# Altium schematic sheet PLIS_POWER.SchDoc
size 420 x 297 mm; Address1: Address1; Address2: Address2; Address3: Address3; Address4: Address4; DocumentNumber: Э3; SheetNumber: 3; SheetTotal: 5; Scale: 1:1; DocumentType: Схема электрическая принципиальная; FirstReferrence: АБВГ.123456.001
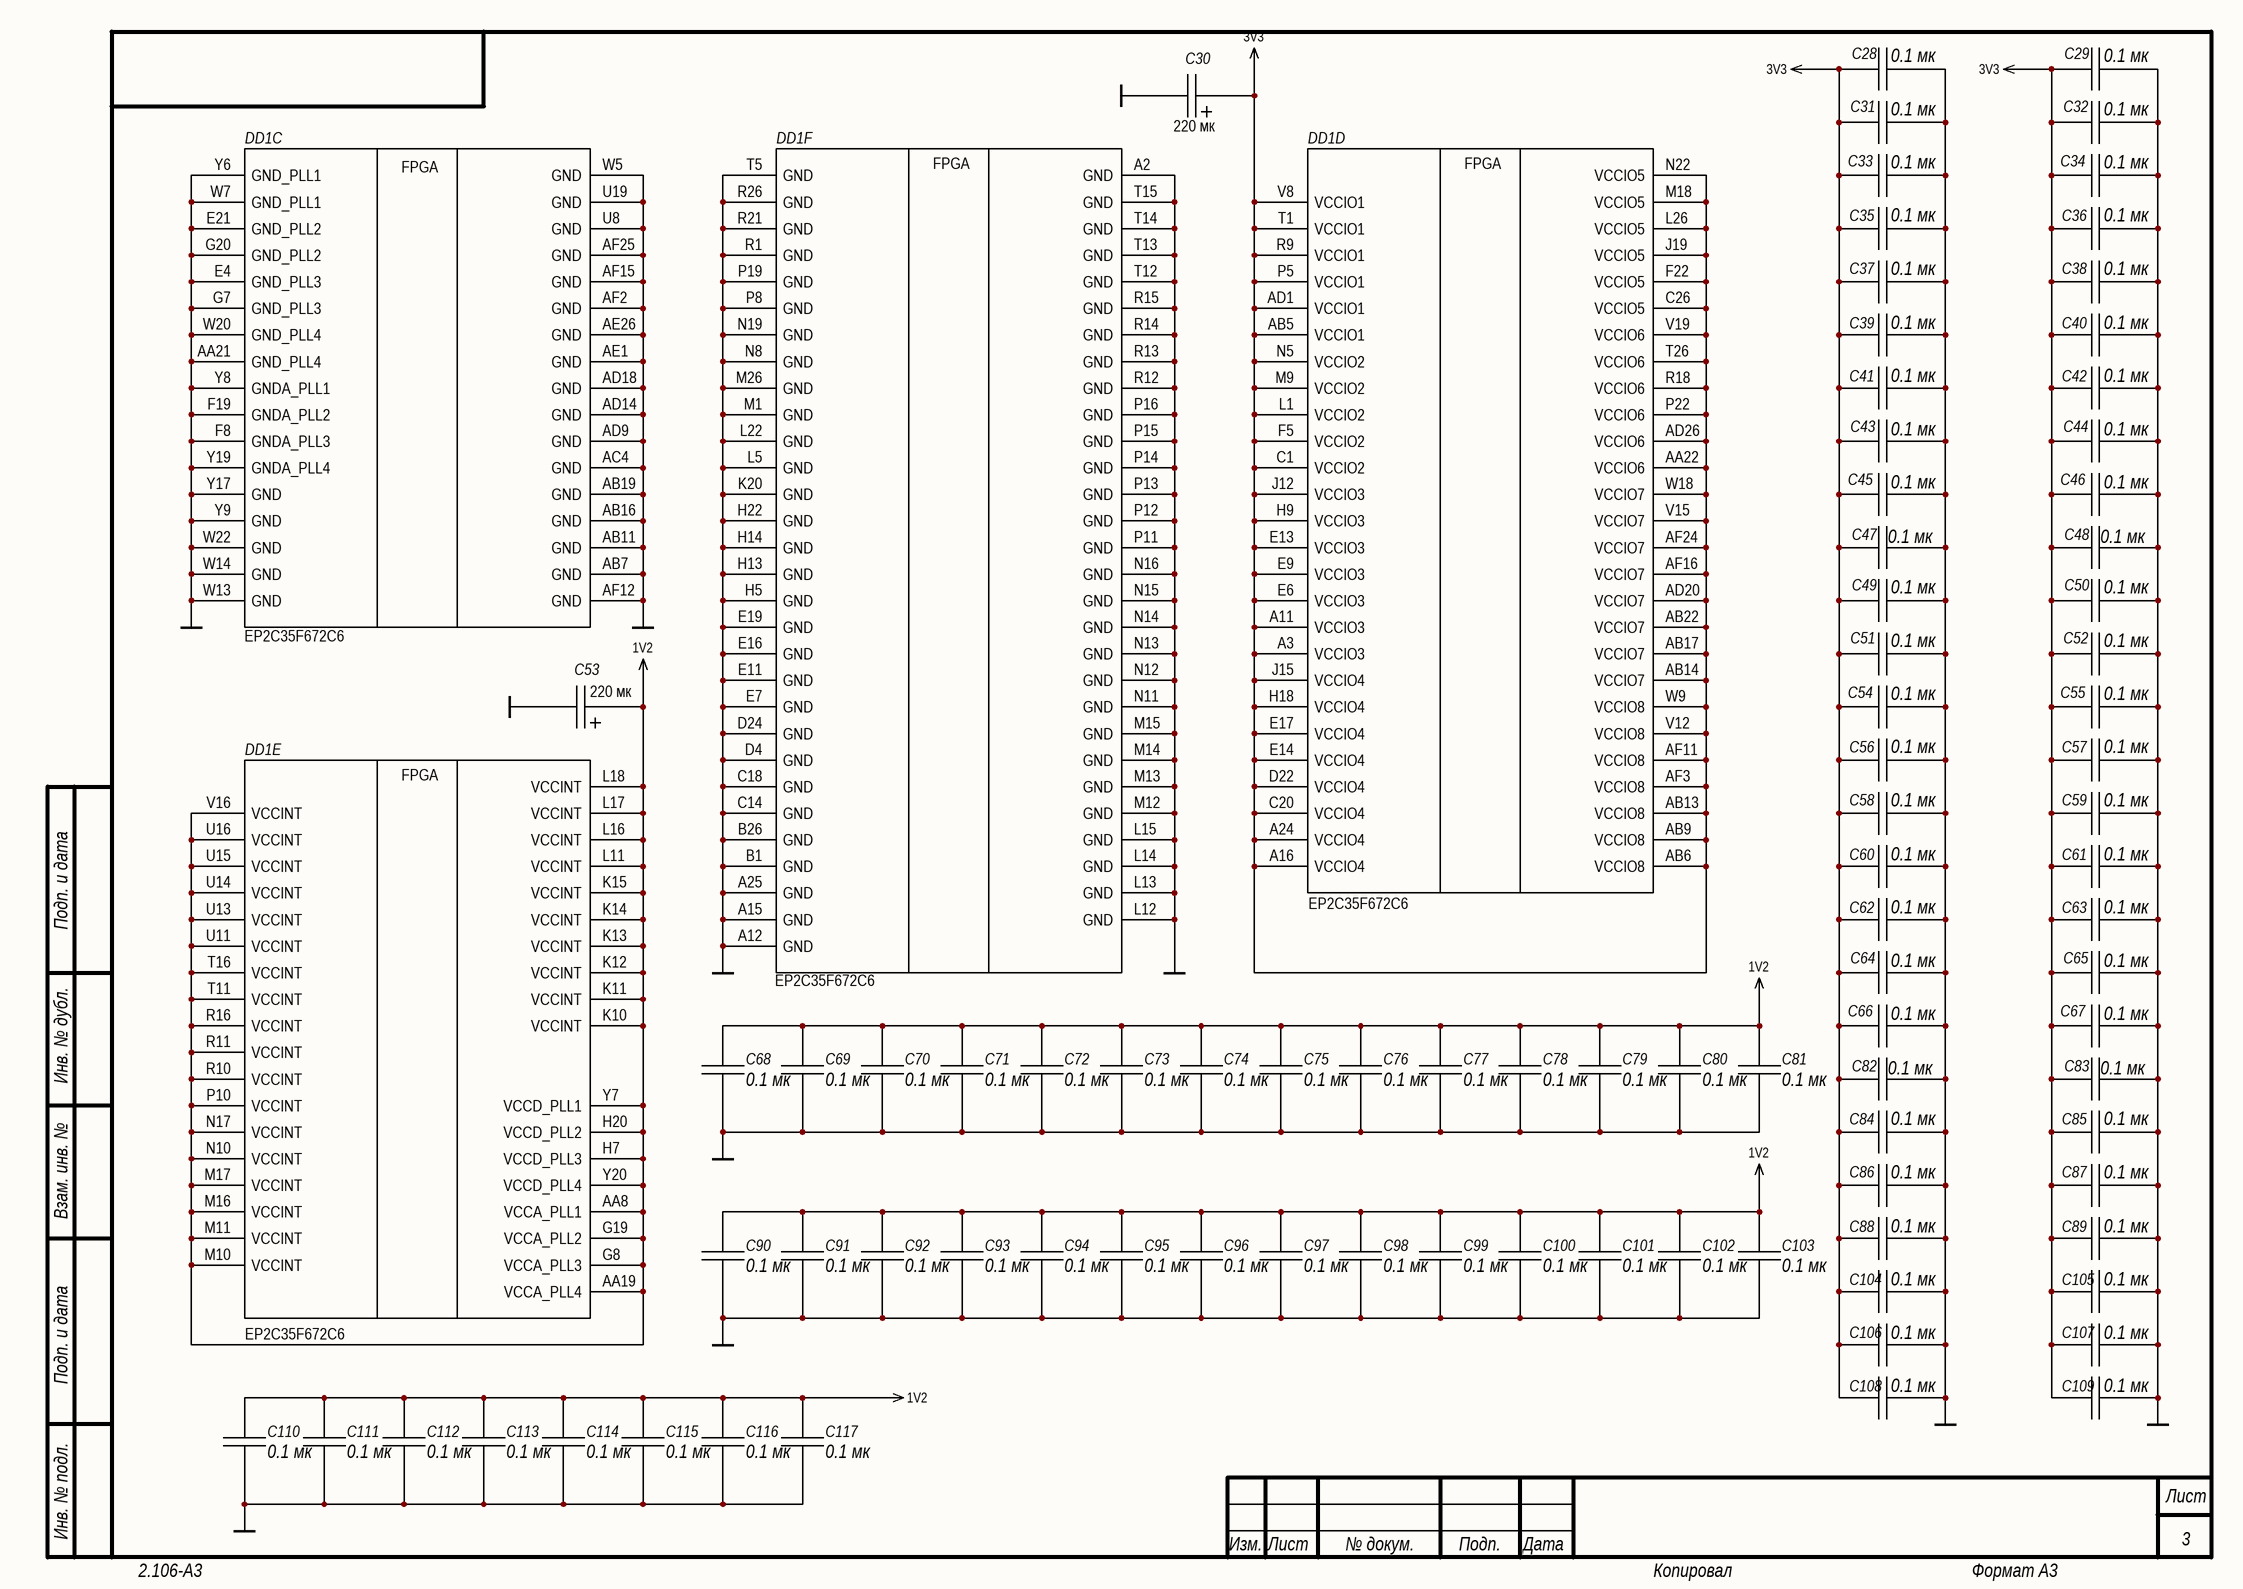
[diagram p0: PLIS_POWER.SchDoc]

## Parts
C28  0.1 мк
C29  0.1 мк
C30  (no value)
C31  0.1 мк
C32  0.1 мк
C33  0.1 мк
C34  0.1 мк
C35  0.1 мк
C36  0.1 мк
C37  0.1 мк
C38  0.1 мк
C39  0.1 мк
C40  0.1 мк
C41  0.1 мк
C42  0.1 мк
C43  0.1 мк
C44  0.1 мк
C45  0.1 мк
C46  0.1 мк
C47  0.1 мк
C48  0.1 мк
C49  0.1 мк
C50  0.1 мк
C51  0.1 мк
C52  0.1 мк
C53  (no value)
C54  0.1 мк
C55  0.1 мк
C56  0.1 мк
C57  0.1 мк
C58  0.1 мк
C59  0.1 мк
C60  0.1 мк
C61  0.1 мк
C62  0.1 мк
C63  0.1 мк
C64  0.1 мк
C65  0.1 мк
C66  0.1 мк
C67  0.1 мк
C68  0.1 мк
C69  0.1 мк
C70  0.1 мк
C71  0.1 мк
C72  0.1 мк
C73  0.1 мк
C74  0.1 мк
C75  0.1 мк
C76  0.1 мк
C77  0.1 мк
C78  0.1 мк
C79  0.1 мк
C80  0.1 мк
C81  0.1 мк
C82  0.1 мк
C83  0.1 мк
C84  0.1 мк
C85  0.1 мк
C86  0.1 мк
C87  0.1 мк
C88  0.1 мк
C89  0.1 мк
C90  0.1 мк
C91  0.1 мк
C92  0.1 мк
C93  0.1 мк
C94  0.1 мк
C95  0.1 мк
C96  0.1 мк
C97  0.1 мк
C98  0.1 мк
C99  0.1 мк
C100  0.1 мк
C101  0.1 мк
C102  0.1 мк
C103  0.1 мк
C104  0.1 мк
C105  0.1 мк
C106  0.1 мк
C107  0.1 мк
C108  0.1 мк
C109  0.1 мк
C110  0.1 мк
C111  0.1 мк
C112  0.1 мк
C113  0.1 мк
C114  0.1 мк
C115  0.1 мк
C116  0.1 мк
C117  0.1 мк
DD1  EP2C35F672C6  (parts C,D,E,F of 7)

## Nets
1V2: C53.2 C68.1 C69.1 C70.1 C71.1 C72.1 C73.1 C74.1 C75.1 C76.1 C77.1 C78.1 C79.1 C80.1 C81.1 C90.1 C91.1 C92.1 C93.1 C94.1 C95.1 C96.1 C97.1 C98.1 C99.1 C100.1 C101.1 C102.1 C103.1 C110.1 C111.1 C112.1 C113.1 C114.1 C115.1 C116.1 C117.1 DD1.AA8(VCCA_PLL1) DD1.AA19(VCCA_PLL4) DD1.G8(VCCA_PLL3) DD1.G19(VCCA_PLL2) DD1.H7(VCCD_PLL3) DD1.H20(VCCD_PLL2) DD1.K10(VCCINT) DD1.K11(VCCINT) DD1.K12(VCCINT) DD1.K13(VCCINT) DD1.K14(VCCINT) DD1.K15(VCCINT) DD1.L11(VCCINT) DD1.L16(VCCINT) DD1.L17(VCCINT) DD1.L18(VCCINT) DD1.M10(VCCINT) DD1.M11(VCCINT) DD1.M16(VCCINT) DD1.M17(VCCINT) DD1.N10(VCCINT) DD1.N17(VCCINT) DD1.P10(VCCINT) DD1.R10(VCCINT) DD1.R11(VCCINT) DD1.R16(VCCINT) DD1.T11(VCCINT) DD1.T16(VCCINT) DD1.U11(VCCINT) DD1.U13(VCCINT) DD1.U14(VCCINT) DD1.U15(VCCINT) DD1.U16(VCCINT) DD1.V16(VCCINT) DD1.Y7(VCCD_PLL1) DD1.Y20(VCCD_PLL4)
3V3: C28.1 C29.1 C30.2 C31.1 C32.1 C33.1 C34.1 C35.1 C36.1 C37.1 C38.1 C39.1 C40.1 C41.1 C42.1 C43.1 C44.1 C45.1 C46.1 C47.1 C48.1 C49.1 C50.1 C51.1 C52.1 C54.1 C55.1 C56.1 C57.1 C58.1 C59.1 C60.1 C61.1 C62.1 C63.1 C64.1 C65.1 C66.1 C67.1 C82.1 C83.1 C84.1 C85.1 C86.1 C87.1 C88.1 C89.1 C104.1 C105.1 C106.1 C107.1 C108.1 C109.1 DD1.A3(VCCIO3) DD1.A11(VCCIO3) DD1.A16(VCCIO4) DD1.A24(VCCIO4) DD1.AA22(VCCIO6) DD1.AB5(VCCIO1) DD1.AB6(VCCIO8) DD1.AB9(VCCIO8) DD1.AB13(VCCIO8) DD1.AB14(VCCIO7) DD1.AB17(VCCIO7) DD1.AB22(VCCIO7) DD1.AD1(VCCIO1) DD1.AD20(VCCIO7) DD1.AD26(VCCIO6) DD1.AF3(VCCIO8) DD1.AF11(VCCIO8) DD1.AF16(VCCIO7) DD1.AF24(VCCIO7) DD1.C1(VCCIO2) DD1.C20(VCCIO4) DD1.C26(VCCIO5) DD1.D22(VCCIO4) DD1.E6(VCCIO3) DD1.E9(VCCIO3) DD1.E13(VCCIO3) DD1.E14(VCCIO4) DD1.E17(VCCIO4) DD1.F5(VCCIO2) DD1.F22(VCCIO5) DD1.H9(VCCIO3) DD1.H18(VCCIO4) DD1.J12(VCCIO3) DD1.J15(VCCIO4) DD1.J19(VCCIO5) DD1.L1(VCCIO2) DD1.L26(VCCIO5) DD1.M9(VCCIO2) DD1.M18(VCCIO5) DD1.N5(VCCIO2) DD1.N22(VCCIO5) DD1.P5(VCCIO1) DD1.P22(VCCIO6) DD1.R9(VCCIO1) DD1.R18(VCCIO6) DD1.T1(VCCIO1) DD1.T26(VCCIO6) DD1.V8(VCCIO1) DD1.V12(VCCIO8) DD1.V15(VCCIO7) DD1.V19(VCCIO6) DD1.W9(VCCIO8) DD1.W18(VCCIO7)
GND: C28.2 C29.2 C30.1 C31.2 C32.2 C33.2 C34.2 C35.2 C36.2 C37.2 C38.2 C39.2 C40.2 C41.2 C42.2 C43.2 C44.2 C45.2 C46.2 C47.2 C48.2 C49.2 C50.2 C51.2 C52.2 C53.1 C54.2 C55.2 C56.2 C57.2 C58.2 C59.2 C60.2 C61.2 C62.2 C63.2 C64.2 C65.2 C66.2 C67.2 C68.2 C69.2 C70.2 C71.2 C72.2 C73.2 C74.2 C75.2 C76.2 C77.2 C78.2 C79.2 C80.2 C81.2 C82.2 C83.2 C84.2 C85.2 C86.2 C87.2 C88.2 C89.2 C90.2 C91.2 C92.2 C93.2 C94.2 C95.2 C96.2 C97.2 C98.2 C99.2 C100.2 C101.2 C102.2 C103.2 C104.2 C105.2 C106.2 C107.2 C108.2 C109.2 C110.2 C111.2 C112.2 C113.2 C114.2 C115.2 C116.2 C117.2 DD1.A2(GND) DD1.A12(GND) DD1.A15(GND) DD1.A25(GND) DD1.AA21(GND_PLL4) DD1.AB7(GND) DD1.AB11(GND) DD1.AB16(GND) DD1.AB19(GND) DD1.AC4(GND) DD1.AD9(GND) DD1.AD14(GND) DD1.AD18(GND) DD1.AE1(GND) DD1.AE26(GND) DD1.AF2(GND) DD1.AF12(GND) DD1.AF15(GND) DD1.AF25(GND) DD1.B1(GND) DD1.B26(GND) DD1.C14(GND) DD1.C18(GND) DD1.D4(GND) DD1.D24(GND) DD1.E4(GND_PLL3) DD1.E7(GND) DD1.E11(GND) DD1.E16(GND) DD1.E19(GND) DD1.E21(GND_PLL2) DD1.F8(GNDA_PLL3) DD1.F19(GNDA_PLL2) DD1.G7(GND_PLL3) DD1.G20(GND_PLL2) DD1.H5(GND) DD1.H13(GND) DD1.H14(GND) DD1.H22(GND) DD1.K20(GND) DD1.L5(GND) DD1.L12(GND) DD1.L13(GND) DD1.L14(GND) DD1.L15(GND) DD1.L22(GND) DD1.M1(GND) DD1.M12(GND) DD1.M13(GND) DD1.M14(GND) DD1.M15(GND) DD1.M26(GND) DD1.N8(GND) DD1.N11(GND) DD1.N12(GND) DD1.N13(GND) DD1.N14(GND) DD1.N15(GND) DD1.N16(GND) DD1.N19(GND) DD1.P8(GND) DD1.P11(GND) DD1.P12(GND) DD1.P13(GND) DD1.P14(GND) DD1.P15(GND) DD1.P16(GND) DD1.P19(GND) DD1.R1(GND) DD1.R12(GND) DD1.R13(GND) DD1.R14(GND) DD1.R15(GND) DD1.R21(GND) DD1.R26(GND) DD1.T5(GND) DD1.T12(GND) DD1.T13(GND) DD1.T14(GND) DD1.T15(GND) DD1.U8(GND) DD1.U19(GND) DD1.W5(GND) DD1.W7(GND_PLL1) DD1.W13(GND) DD1.W14(GND) DD1.W20(GND_PLL4) DD1.W22(GND) DD1.Y6(GND_PLL1) DD1.Y8(GNDA_PLL1) DD1.Y9(GND) DD1.Y17(GND) DD1.Y19(GNDA_PLL4)

## Notes on the sheet
- (near C30) 220 мк
- (near C53) 220 мк
- Подп. и дата
- Инв. № дубл.
- Взам. инв. №
- Инв. № подл.
- Изм.
- Лист
- № докум.
- Подп.
- Дата
- 2.106-A3
- Копировал
- Формат А3
- (in symbol PLIS, part C) FPGA
- (in symbol PLIS, part D) FPGA
- (in symbol PLIS, part E) FPGA
- (in symbol PLIS, part F) FPGA

## Library data of the parts
C28 C29 C31-C52 C54-C117 = C: ValueType: Конденсатор
C30 C53 = C_POL: ValueType: Конденсатор
DD1 = PLIS